# EAGLE design Bootloader Helper  (EAGLE 9.6.2)
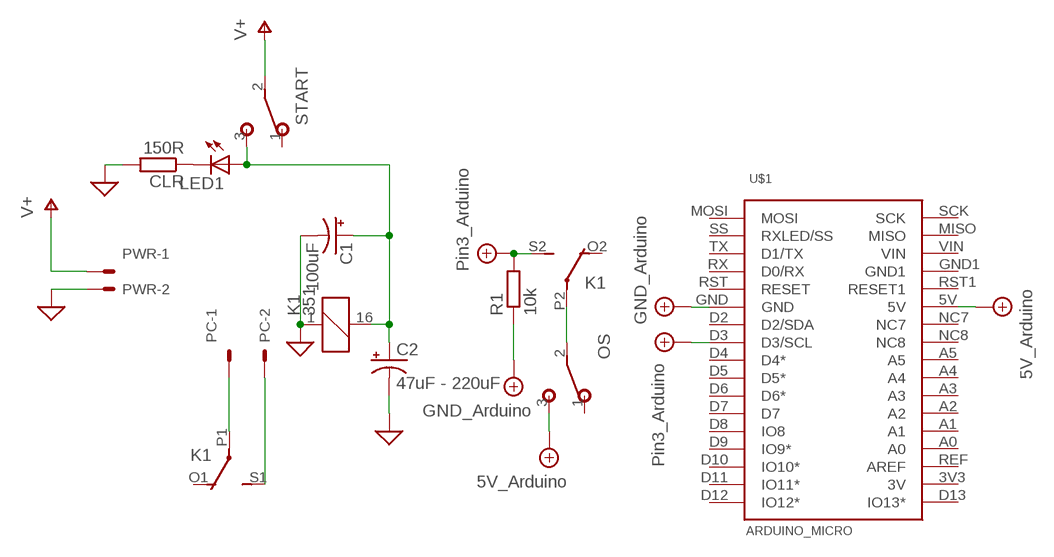
[diagram p0: schematic, sheet 1]

## Parts
C1  100uF  CPOL-USE2-4  [E2-4]
C2  47uF - 220uF  CPOL-USE2.5-7  [E2,5-7]
CLR  150R  R-EU_0204/7  [0204/7]
K1  351  [351]
LED1  LED5MM  [LED5MM]
OS  SPDTPADS  [SPDT]
PC  ext. Power  22-23-2021  [22-23-2021]
PWR  ext. Power  22-23-2021  [22-23-2021]
R1  10k  R-EU_0204/7  [0204/7]
START  SPDTPADS  [SPDT]
U$1  ARDUINO_MICRO  ARDUINO_MICROFOOTPRINT  [ARDUINO-MICRO]

## Nets
GND: C1.- C2.- CLR.2 K1.1 PWR.2 ; supply symbol labelled SUP
N$2: K1.P1(2:P) PC.1
N$3: C1.+ C2.+ K1.16 LED1.A START.3(S)
N$4: CLR.1 LED1.K(C)
N$6: K1.S1(2:S) PC.2
N$7: K1.P2(3:P) OS.2(P)
V+: PWR.1 START.2(P)
VB: R1.1 U$1.GND ; supply symbol labelled GND_Arduino
VC: K1.S2(3:S) R1.2 U$1.D3(D3/SCL) ; supply symbol labelled Pin3_Arduino
VR: OS.3(S) U$1.5V ; supply symbol labelled 5V_Arduino
Unconnected: K1.O1(2:O) K1.O2(3:O) OS.1(O) START.1(O) U$1.3V3(3V) U$1.A0 U$1.A1 U$1.A2 U$1.A3 U$1.A4 U$1.A5 U$1.D2(D2/SDA) U$1.D4(D4*) U$1.D5(D5*) U$1.D6(D6*) U$1.D7 U$1.D8(IO8) U$1.D9(IO9*) U$1.D10(IO10*) U$1.D11(IO11*) U$1.D12(IO12*) U$1.D13(IO13*) U$1.GND1 U$1.MISO U$1.MOSI U$1.NC7 U$1.NC8 U$1.REF(AREF) U$1.RST1(RESET1) U$1.RST(RESET) U$1.RX(D0/RX) U$1.SCK U$1.SS(RXLED/SS) U$1.TX(D1/TX) U$1.VIN

## Library data of the parts
C1 C2 = adafruit:CPOL-US: POLARIZED CAPACITOR, American symbol
CLR R1 = rcl:R-EU_: RESISTOR, European symbol; SPICEPREFIX: R
K1 = FTR-B3CA4.5:351: RELAY 2 x switch, Omron; OC_FARNELL: unknown; OC_NEWARK: unknown
LED1 = adafruit:LED: LED OSRAM: - CHIPLED LG R971, LG N971, LY N971, LG Q971, LY Q971, LO R971, LY R971 LH N974, LH R974 LS Q976, LO Q976, LY Q976 LO Q996 - Hyper CHIPLED LW Q18S LB Q993, LB Q99A, LB R99A - SideLED LS A670, LO A670, LY A670, LG A670, LP A670 LB A673, LV A673, LT A673, LW A673 LH A674 LY A675 LS A676, LA A676, LO A676, LY A676, LW A676 LS A679, LY A679, LG A679 - Hyper Micro SIDELED® LS Y876, LA Y876, LO Y876, LY Y876 LT Y87S - SmartLED LW L88C, LW L88S LB L89C, LB L89S, LG L890 LS L89K, LO L89K, LY L89K LS L896, LA L896, LO L896, LY L896 - TOPLED LS T670, LO T670, LY T670, LG T670, LP T670 LSG T670, LSP T670, LSY T670, LOP T670, LYG T670 LG T671, LOG T671, LSG T671 LB T673, LV T673, LT T673, LW T673 LH T674 LS T676, LA T676, LO T676, LY T676, LB T676, LH T676, LSB T676, LW T676 LB T67C, LV T67C, LT T67C, LS T67K, LO T67K, LY T67K, LW E67C LS E67B, LA E67B, LO E67B, LY E67B, LB E67C, LV E67C, LT E67C LW T67C LS T679, LY T679, LG T679 LS T770, LO T770, LY T770, LG T770, LP T770 LB T773, LV T773, LT T773, LW T773 LH T774 LS E675, LA E675, LY E675, LS T675 LS T776, LA T776, LO T776, LY T776, LB T776 LHGB T686 LT T68C, LB T68C - Hyper Mini TOPLED® LB M676 - Mini TOPLED Santana® LG M470 LS M47K, LO M47K, LY M47K Source: http://www.osram.convergy.de/
OS START = switches:SPDT: TOGGLE SWITCH Marquardt
PC PWR = con-molex:22-23-2021: .100" (2.54mm) Center Header - 2 Pin; MF: MOLEX; MPN: 22-23-2021; OC_FARNELL: 1462926; OC_NEWARK: 25C3832
U$1 = arduino-micro:ARDUINO_MICRO

## Board
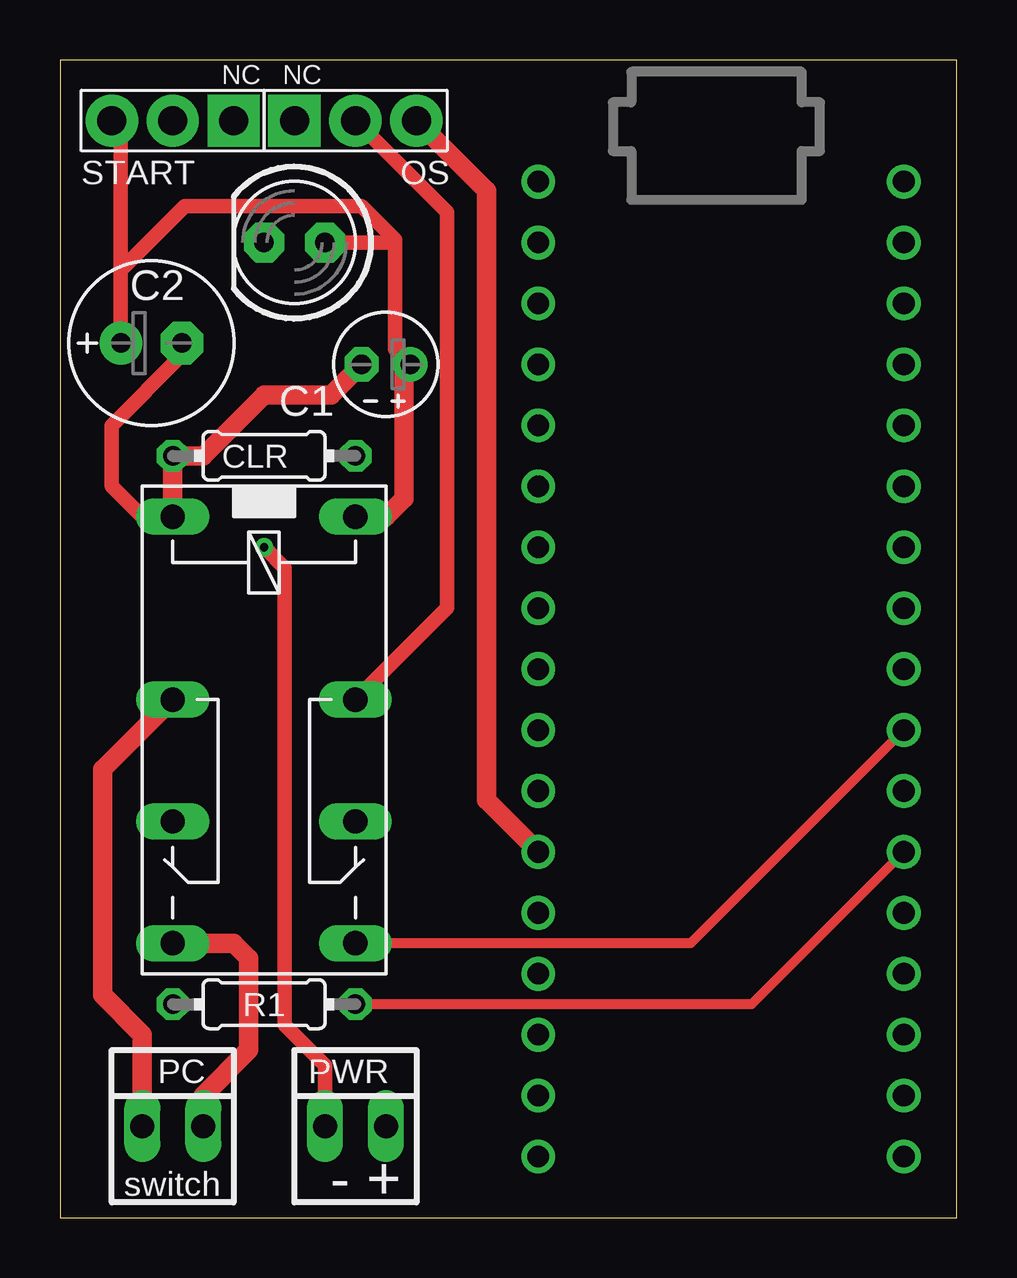
[diagram p1: board, top side]
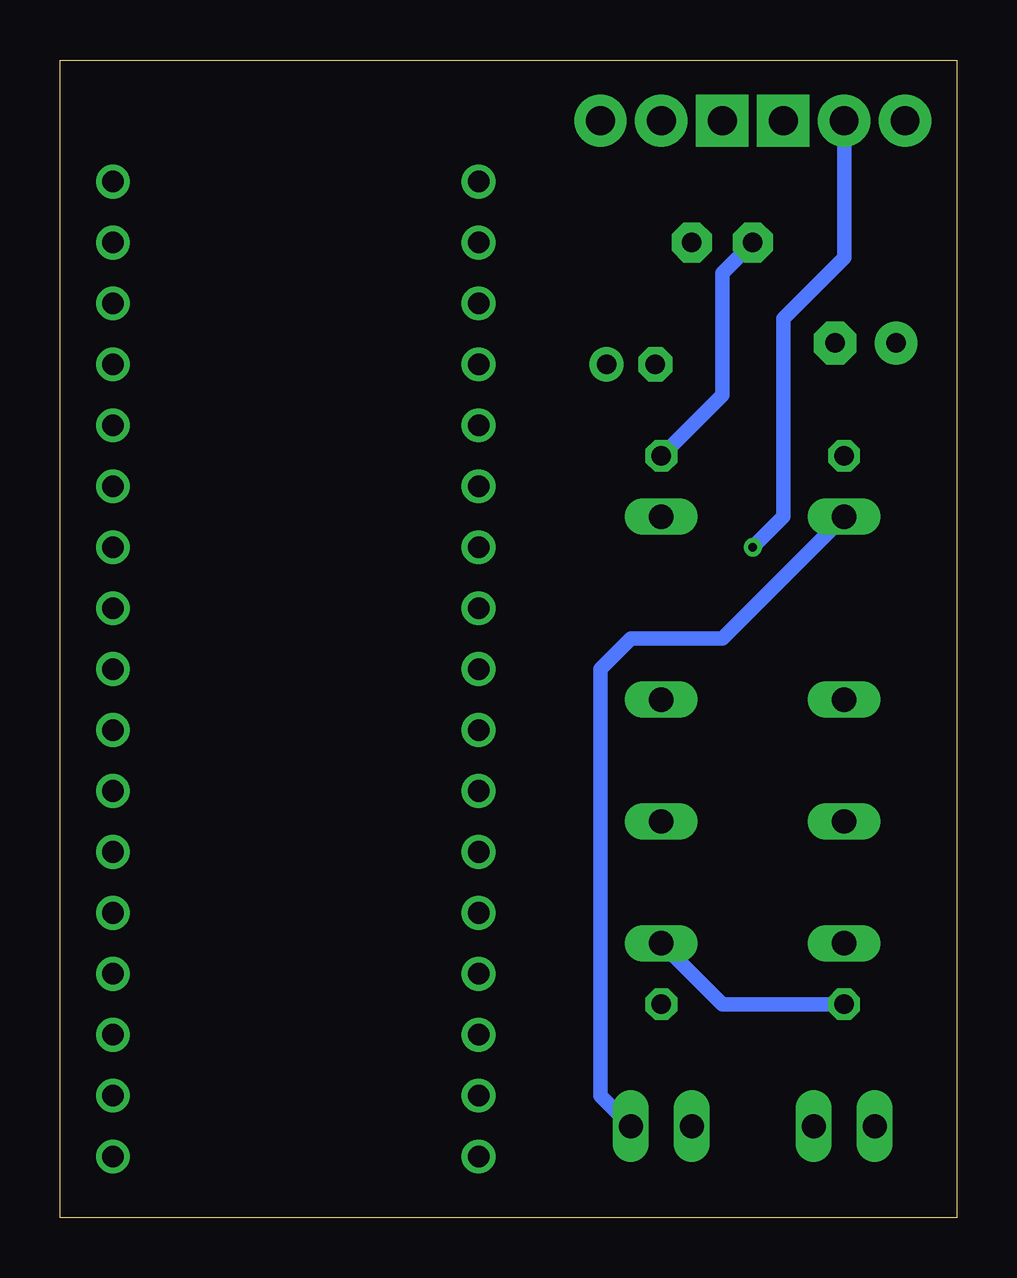
[diagram p2: board, bottom side, seen from below]

Size 37.39 x 48.25 mm. Coordinates in mm from the lower left corner, seen from the top.
Outline: 0,0 37.39,0 37.39,48.25 0,48.25 0,0
Copper layers (1*16): Top 0.035mm / dielectric 1.5mm / Bottom 0.035mm
Design rules "default": minimum track width 6mil, minimum drill 0.35mm, track to track 6mil, track to pad 6mil, pad to pad 6mil, via to via 6mil, smd to smd 6mil, copper to edge 40mil, drill to drill 6mil, minimum pad ring 10mil, minimum via ring 8mil, stop-mask expansion 4mil, vias tented up to drill 0mil, thermal gap 10mil

### Footprints (pad centres in the part's own frame; a part is rotated, then mirrored left to right if it is on the bottom)
E2-4 = drill 0.813 pad 1.422: + -1.016,0 | drill 0.813 pad 1.422 octagon: - 1.016,0
E2,5-7 = drill 0.813 pad 1.778: + -1.27,0 | drill 0.813 pad 1.778 octagon: - 1.27,0
0204/7 = drill 0.813 octagon: 1 -3.81,0; 2 3.81,0
351 = drill 1.016 long: 1 -3.81,-3.81; 16 -3.81,3.81; O1 8.89,-3.81; O2 8.89,3.81; P1 3.81,-3.81; P2 3.81,3.81; S1 13.97,-3.81; S2 13.97,3.81
LED5MM = drill 0.813 pad 1.676 octagon: A -1.27,0; K 1.27,0
SPDT = drill 1.2 pad 2.184 square: 1 -2.54,0 | drill 1.2 pad 2.184: 2 0,0; 3 2.54,0
22-23-2021 = drill 1 long: 1 -1.27,0; 2 1.27,0
ARDUINO-MICRO = drill 0.9: 3V3 16.51,3.81; 5V 16.51,29.21; A0 16.51,8.89; A1 16.51,11.43; A2 16.51,13.97; A3 16.51,16.51; A4 16.51,19.05; A5 16.51,21.59; D2 1.27,26.67; D3 1.27,24.13; D4 1.27,21.59; D5 1.27,19.05; D6 1.27,16.51; D7 1.27,13.97; D8 1.27,11.43; D9 1.27,8.89; D10 1.27,6.35; D11 1.27,3.81; D12 1.27,1.27; D13 16.51,1.27; GND 1.27,29.21; GND1 16.51,34.29; MISO 16.51,39.37; MOSI 1.27,41.91; NC7 16.51,26.67; NC8 16.51,24.13; REF 16.51,6.35; RST 1.27,31.75; RST1 16.51,31.75; RX 1.27,34.29; SCK 16.51,41.91; SS 1.27,39.37; TX 1.27,36.83; VIN 16.51,36.83

### Placement (x,y rotation side)
C1  13.59,35.56 180 top
C2  3.81,36.45 0 top
CLR  8.51,31.75 180 top
K1  8.51,25.4 270 top
LED1  9.78,40.64 180 top
OS  12.32,45.72 0 top
PC  4.7,3.81 0 top
PWR  12.32,3.81 0 top
R1  8.51,8.89 180 top
START  4.7,45.72 180 top
U$1  36.45,44.45 180 top

### Tracks (layer width: path | path; a pad name or v marks a point on that pad's centre or on a via)
GND
  Top 0.61: C2.- 5.08,35.94 2.16,33.02 2.16,30.48 3.43,29.21 K1.1
  Top 0.813: C1.- 11.3,34.29 8.51,34.29 5.97,31.75 CLR.2 K1.1
  Bottom 0.61: K1.1 9.78,24.13 13.59,24.13 14.86,22.86 14.86,5.08 PWR.2
N$2
  Top 0.813: K1.P1 1.78,18.67 1.78,9.27 3.43,7.62 PC.1
N$3
  Top 0.61: C2.+ 2.54,39.5 | 2.54,39.5 5.21,42.16 12.57,42.16 13.97,40.77 13.97,40.64 | 13.97,40.64 13.97,36.2 C1.+ | START.3 2.54,45.34 2.54,39.5 | LED1.A 13.97,40.64
  Top 0.813: C1.+ 14.35,35.31 14.35,29.97 13.59,29.21 K1.16
N$4
  Bottom 0.61: LED1.K 9.78,39.37 9.78,34.29 CLR.1
N$6
  Top 0.813: K1.S1 7.24,11.43 7.87,10.79 7.87,6.98 5.97,5.08 PC.2
N$7
  Top 0.61: OS.2 16.13,41.91 16.13,25.4 K1.P2
V+  (via drill 0.35)
  Top 0.61: PWR.1 11.05,6.35 9.37,8.03 9.37,27.08 v8.51,27.94
  Bottom 0.61: v8.51,27.94 7.24,29.21 7.24,37.46 4.7,40 START.2
VB
  Top 0.406: U$1.GND 28.83,8.89 R1.1
VC
  Top 0.406: U$1.D3 26.29,11.43 K1.S2
  Bottom 0.61: K1.S2 9.78,8.89 R1.2
VR
  Top 0.813: OS.3 17.78,42.8 17.78,17.4 U$1.5V

### Text on the board
tPlace: - + | switch
tNames: NC | NC
Measures: size is as small as possible | expand the board and place holes as you like